# EAGLE design 12V51A MC34063 (EAGLE 8.5.1)
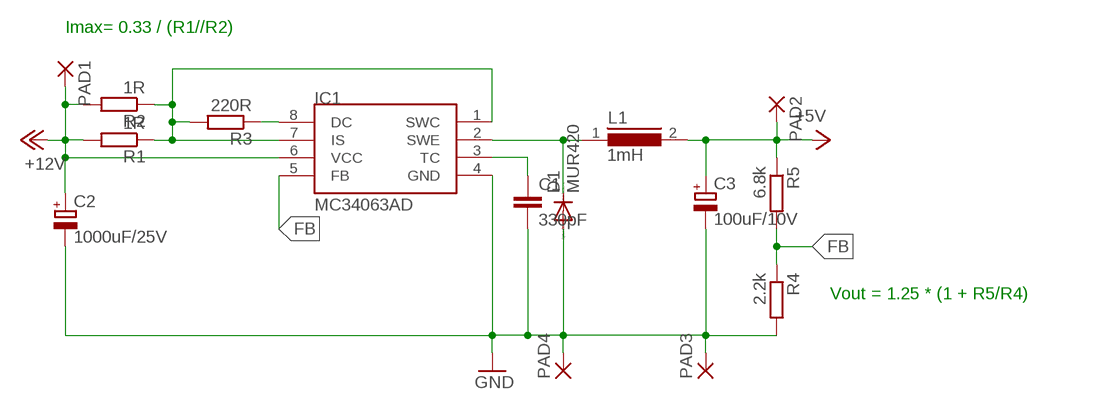
[diagram p0: schematic, sheet 1]

## Parts
C1  330pF  C-EU050-024X044  [C050-024X044]
C2  1000uF/25V  CPOL-EUE2.5-7  [E2,5-7]
C3  100uF/10V  CPOL-EUE2.5-7  [E2,5-7]
D1  MUR420  1N4148DO35-7  [DO35-7]
IC1  MC34063AD  [SOIC8]
L1  1mH  82114R  [82114R]
PAD1  2,54/1,0  [2,54/1,0]
PAD2  2,54/1,0  [2,54/1,0]
PAD3  2,54/1,0  [2,54/1,0]
PAD4  2,54/1,0  [2,54/1,0]
R1  1R  R-EU_0204/7  [0204/7]
R2  1R  R-EU_0204/7  [0204/7]
R3  220R  R-EU_0204/7  [0204/7]
R4  2.2k  R-EU_0204/7  [0204/7]
R5  6.8k  R-EU_0204/7  [0204/7]

## Nets
+5V: C3.+ L1.2 PAD2.1(P) R5.1
+12V: C2.+ IC1.6(VCC) PAD1.1(P) R1.2 R2.2
FB: IC1.5(FB) R4.1 R5.2
GND: C1.2 C2.- C3.- D1.A IC1.4(GND) PAD3.1(P) PAD4.1(P) R4.2
N$1: IC1.1(SWC) IC1.7(IS) R1.1 R2.1 R3.2
N$3: D1.C IC1.2(SWE) L1.1
N$4: IC1.8(DC) R3.1
N$7: C1.1 IC1.3(TC)

## Notes on the sheet
- Imax= 0.33 / (R1//R2)
- Vout = 1.25 * (1 + R5/R4)

## Library data of the parts
C1 = rcl:C-EU: CAPACITOR, European symbol; SPICEPREFIX: C
C2 C3 = rcl:CPOL-EU: POLARIZED CAPACITOR, European symbol; SPICEPREFIX: C
D1 = diode:1N4148: DIODE high speed (Philips)
IC1 = mc34063:MC34063
L1 = inductors:82114R: INDUCTOR; SPICEPREFIX: L
PAD1-PAD4 = wirepad:2,54/1,0: THROUGH-HOLE PAD
R1-R5 = rcl:R-EU_: RESISTOR, European symbol; SPICEPREFIX: R

## Net classes
0 default: clearance 0.381 mm

## Board
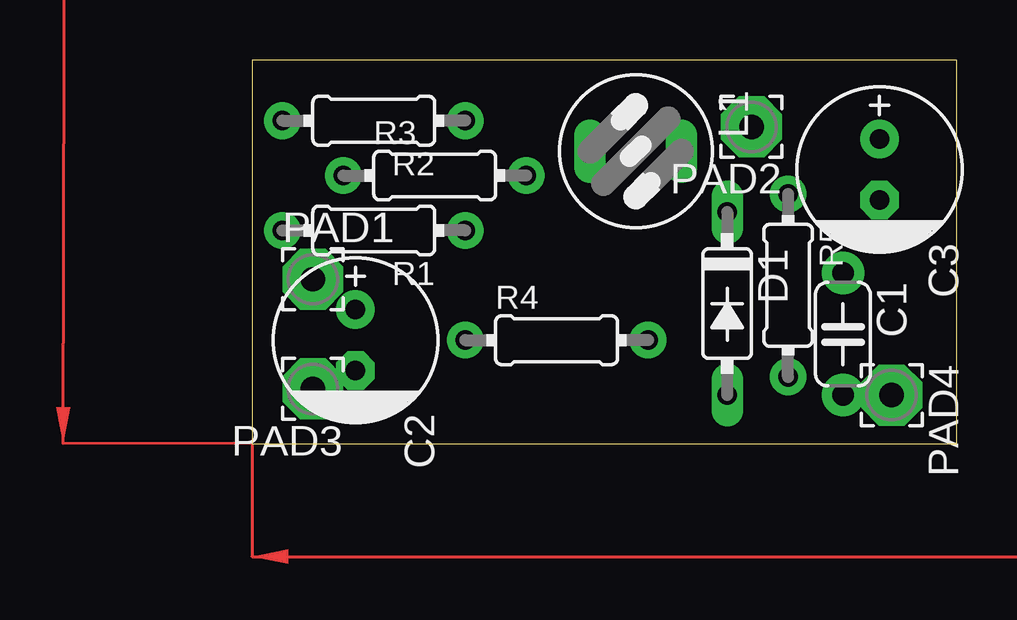
[diagram p1: board, top side]
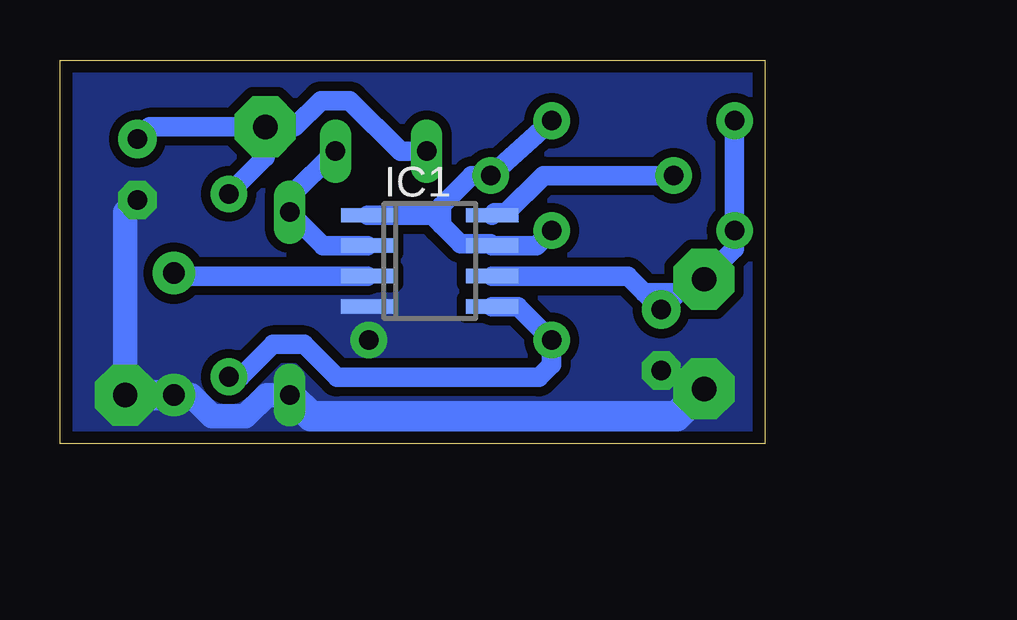
[diagram p2: board, bottom side, seen from below]

Size 29.39 x 15.99 mm. Coordinates in mm from the lower left corner, seen from the top.
Outline: 0,0 29.39,0 29.39,15.99 0,15.99 0,0
Copper layers (1*16): Top 0.035mm / dielectric 1.5mm / Bottom 0.035mm
Design rules "default *": minimum track width 6mil, minimum drill 0.35mm, track to track 6mil, track to pad 6mil, pad to pad 6mil, via to via 6mil, smd to smd 6mil, copper to edge 20mil, drill to drill 8mil, minimum pad ring 10mil, minimum via ring 8mil, stop-mask expansion 4mil, vias tented up to drill 0mil, thermal gap 10mil

### Footprints (pad centres in the part's own frame; a part is rotated, then mirrored left to right if it is on the bottom)
C050-024X044 = drill 0.889 pad 1.778: 1 -2.54,0; 2 2.54,0
E2,5-7 = drill 0.813 pad 1.6: + -1.27,0 | drill 0.813 pad 1.6 octagon: - 1.27,0
DO35-7 = drill 0.813 long: A 3.81,0; C -3.81,0
SOIC8 = smd 0.6 x 2.2: 1 -1.905,-2.6; 2 -0.635,-2.6; 3 0.635,-2.6; 4 1.905,-2.6; 5 1.905,2.6; 6 0.635,2.6; 7 -0.635,2.6; 8 -1.905,2.6
82114R = drill 0.813 long: 1 0,1.905; 2 0,-1.905
2,54/1,0 = drill 1.016 pad 2.54 octagon: 1 0,0
0204/7 = drill 0.813 pad 1.524: 1 -3.81,0; 2 3.81,0

### Placement (x,y rotation side)
C1  24.64,4.57 270 top
C2  4.32,4.32 270 top
C3  26.16,11.43 270 top
D1  19.81,5.84 270 top
IC1  13.97,7.62 270 bottom
L1  16,12.19 270 top
PAD1  2.54,6.86 0 top
PAD2  20.83,13.21 180 top
PAD3  2.54,2.29 180 top
PAD4  26.67,2.03 270 top
R1  5.08,8.89 180 top
R2  5.08,13.46 180 top
R3  7.62,11.18 0 top
R4  12.7,4.32 0 top
R5  22.35,6.6 270 top

### Tracks (layer width: path | path; a pad name or v marks a point on that pad's centre or on a via)
+5V
  Bottom 0.813: L1.2 15.2,12.19 17.31,14.3 18.51,14.3 19.6,13.21 PAD2.1 | PAD2.1 25.65,13.21 C3.+ | R5.1 20.83,11.94 PAD2.1
+12V
  Bottom 0.813: IC1.6 5.71,6.99 5.02,6.29 | 5.02,6.29 C2.+ 3.62,6.29 | R2.2 R1.2 1.27,8.13 PAD1.1 3.05,6.86 3.49,6.41 3.62,6.29 | 5.02,6.29 3.62,6.29
FB
  Bottom 0.813: R5.2 21.85,2.79 20.5,4.14 19.21,4.14 17.84,2.77 9.42,2.77 8.89,3.3 R4.1 10.29,5.71 IC1.5
GND
  Bottom 1.016: D1.A 20.78,2.03 21.67,1.14 23.04,1.14 23.93,2.03 C1.2 | PAD4.1 26.67,9.65 C3.-
  Bottom 1.27: PAD3.1 3.68,1.14 18.92,1.14 D1.A | PAD4.1 C1.2
  pour Bottom (no thermals): -1.02,16 29.72,16 29.72,-1.02 -1.02,-1.02
N$1
  Bottom 0.813: R1.1 9.53,8.26 IC1.7 11.45,8.33 12.69,8.33 13.48,9.12 | R2.1 R3.2 12.23,11.18 13.48,9.93 | 13.88,9.53 IC1.1 | 13.48,9.12 13.88,9.53 | 13.48,9.93 13.88,9.53 | 13.48,9.12 13.48,9.93
N$3
  Bottom 0.813: IC1.2 18.41,8.26 D1.C 19.81,10.29 L1.1
N$4
  Bottom 0.813: IC1.8 11.27,9.63 10.79,9.63 9.24,11.18 R3.1
N$7
  Bottom 0.813: IC1.3 24.51,6.99 C1.1
(copper drawn outside any net)
  shapes: Top area x2